# Altium schematic sheet Bridge.SchDoc
size B
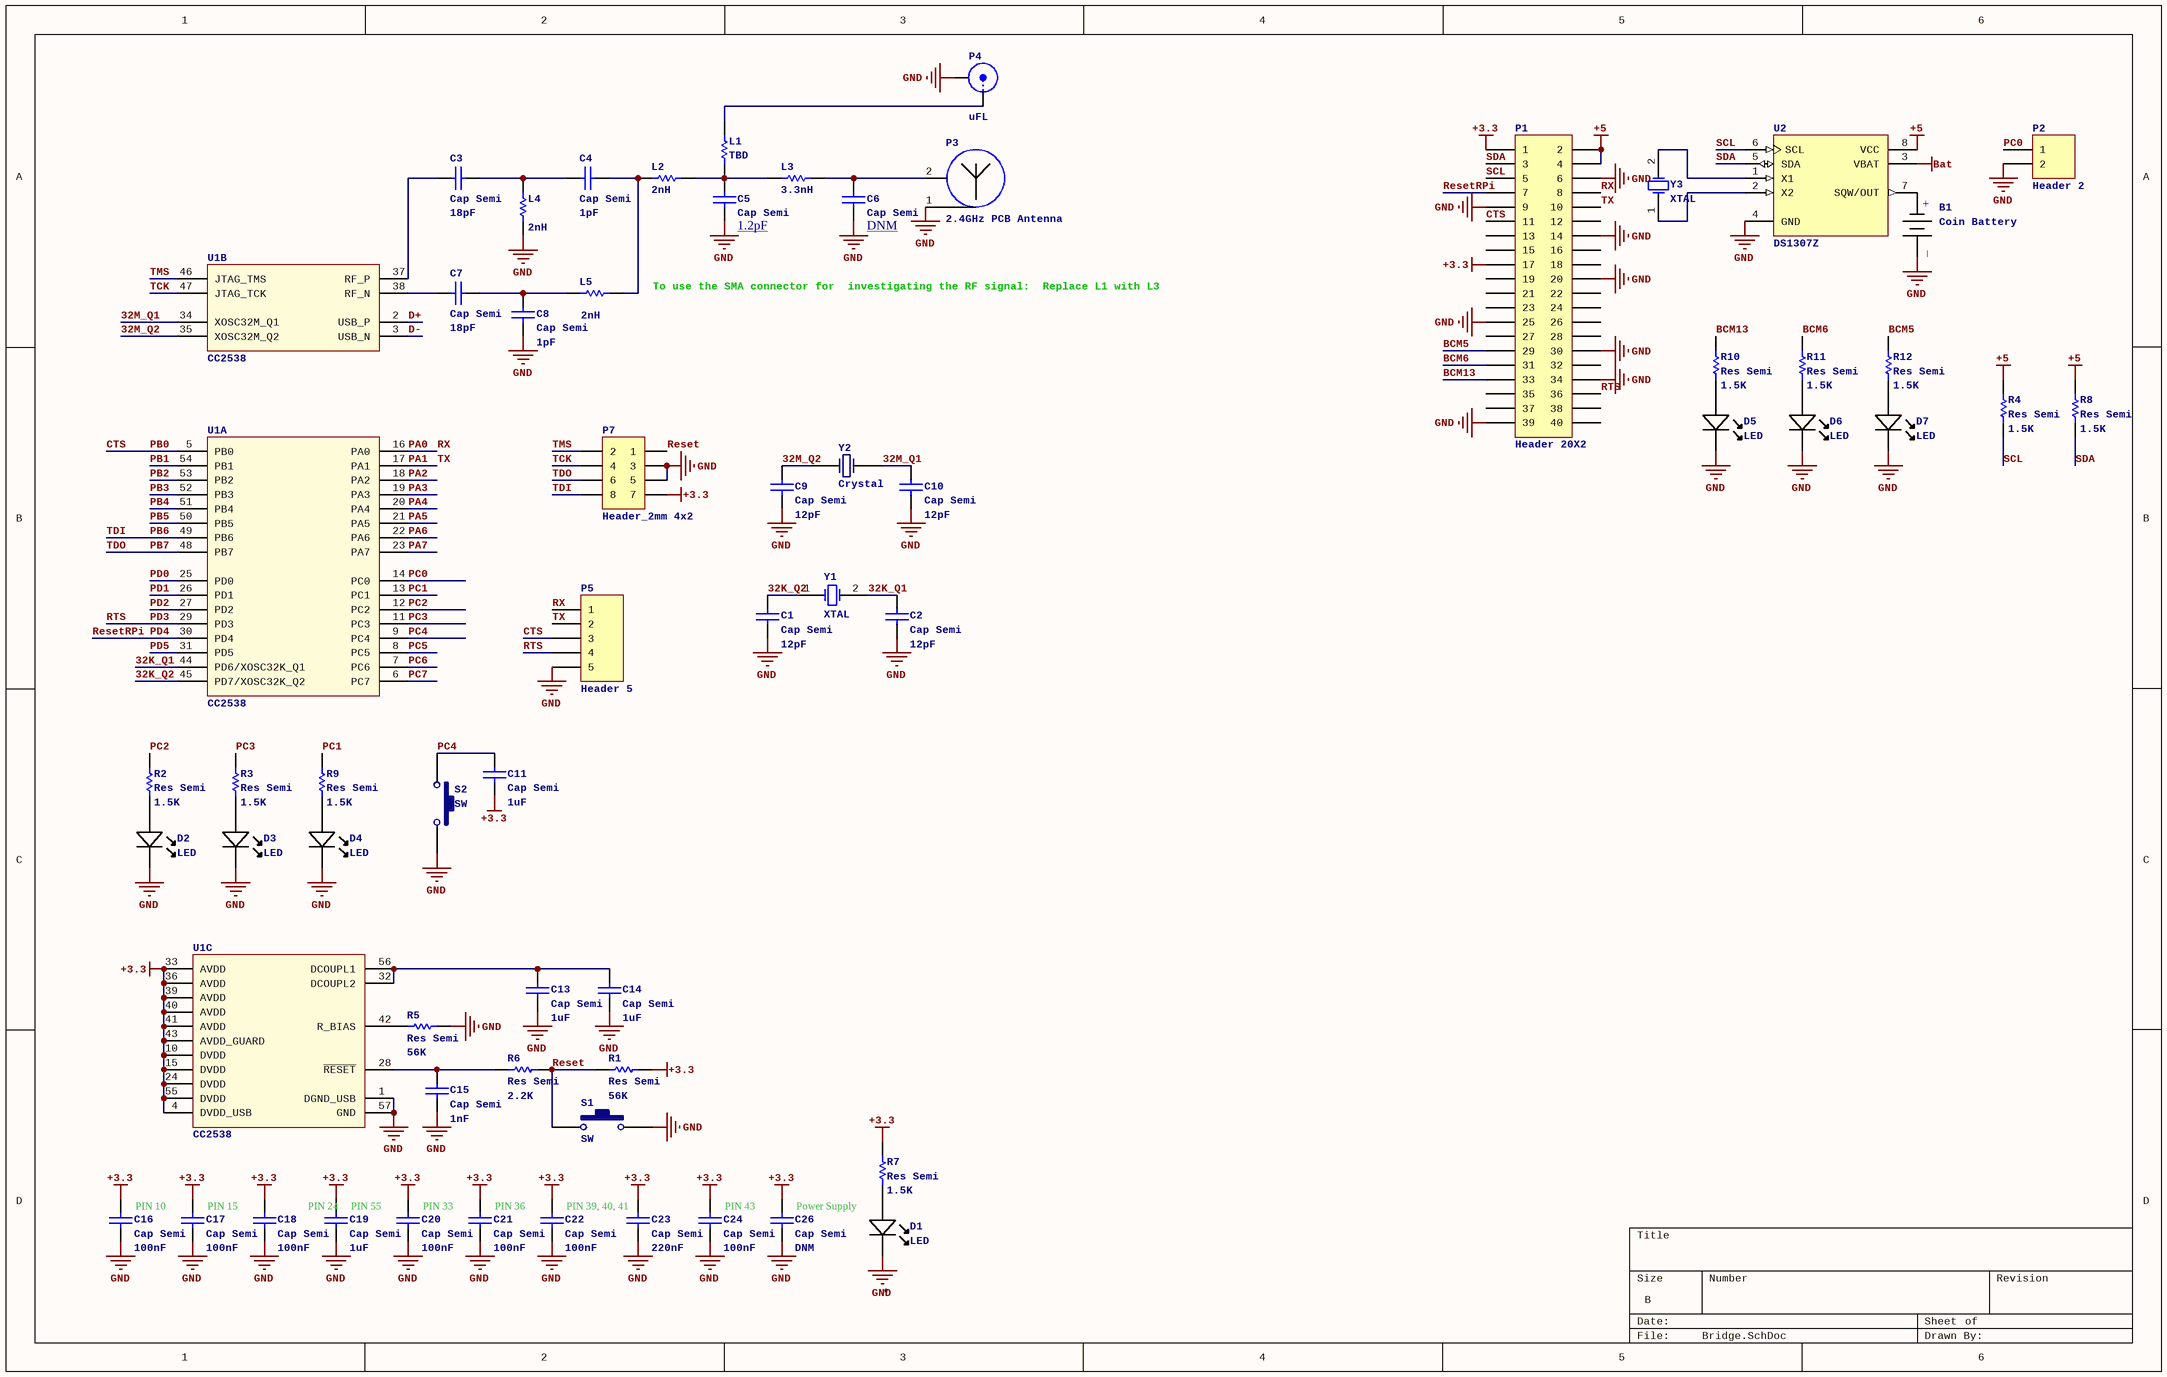
[diagram p0: Bridge.SchDoc]

## Parts
B1  Coin Battery  [Coin Battery 1220]
C1  Cap Semi  value 12pF  [1608[0603]]
C2  Cap Semi  value 12pF  [1608[0603]]
C3  Cap Semi  value 18pF  [1608[0603]]
C4  Cap Semi  value 1pF  [1608[0603]]
C5  Cap Semi  value 1.2pF  [1608[0603]]
C6  Cap Semi  value DNM  [1608[0603]]
C7  Cap Semi  value 18pF  [1608[0603]]
C8  Cap Semi  value 1pF  [1608[0603]]
C9  Cap Semi  value 12pF  [1608[0603]]
C10  Cap Semi  value 12pF  [1608[0603]]
C11  Cap Semi  value 1uF  [1608[0603]]
C13  Cap Semi  value 1uF  [1608[0603]]
C14  Cap Semi  value 1uF  [1608[0603]]
C15  Cap Semi  value 1nF  [1608[0603]]
C16  Cap Semi  value 100nF  [1608[0603]]
C17  Cap Semi  value 100nF  [1608[0603]]
C18  Cap Semi  value 100nF  [1608[0603]]
C19  Cap Semi  value 1uF  [1608[0603]]
C20  Cap Semi  value 100nF  [1608[0603]]
C21  Cap Semi  value 100nF  [1608[0603]]
C22  Cap Semi  value 100nF  [1608[0603]]
C23  Cap Semi  value 220nF  [1608[0603]]
C24  Cap Semi  value 100nF  [1608[0603]]
C26  Cap Semi  value DNM  [1608[0603]]
D1  LED  [LED 0603]
D2  LED  [LED 0603]
D3  LED  [LED 0603]
D4  LED  [LED 0603]
D5  LED  [LED 0603]
D6  LED  [LED 0603]
D7  LED  [LED 0603]
L1  value TBD  [1608[0603]]  (hidden comment: Res Semi)
L2  value 2nH  [1608[0603]]  (hidden comment: Res Semi)
L3  value 3.3nH  [1608[0603]]  (hidden comment: Res Semi)
L4  value 2nH  [1608[0603]]  (hidden comment: Res Semi)
L5  value 2nH  [1608[0603]]  (hidden comment: Res Semi)
P1  Header 20X2  [HDR2X20]
P2  Header 2  [HDR1X2]
P3  2.4GHz PCB Antenna  [2.4 GHz Inverted F Antenna 1]
P4  uFL  [uFL]
P5  Header 5  [HDR1X5]
P7  Header_2mm 4x2  [Header_2mm 4x2]
R1  Res Semi  value 56K  [1608[0603]]
R2  Res Semi  value 1.5K  [1608[0603]]
R3  Res Semi  value 1.5K  [1608[0603]]
R4  Res Semi  value 1.5K  [1608[0603]]
R5  Res Semi  value 56K  [1608[0603]]
R6  Res Semi  value 2.2K  [1608[0603]]
R7  Res Semi  value 1.5K  [1608[0603]]
R8  Res Semi  value 1.5K  [1608[0603]]
R9  Res Semi  value 1.5K  [1608[0603]]
R10  Res Semi  value 1.5K  [1608[0603]]
R11  Res Semi  value 1.5K  [1608[0603]]
R12  Res Semi  value 1.5K  [1608[0603]]
S1  SW  [Switch SMD]
S2  SW  [Switch SMD]
U1  CC2538  [PVQFN56-CC2538]  (parts A,B,C of 3)
U2  DS1307Z  [SOIC8N_N]
Y1  XTAL  [R38]
Y2  Crystal  [Crystal 3225]
Y3  XTAL  [R38]

## Nets
+3.3: C11.1 C16.2 C17.2 C18.2 C19.2 C20.2 C21.2 C22.2 C23.2 C24.2 C26.2 P1.1 P1.17 P7.7 R1.1 R7.2 U1.4(DVDD_USB) U1.10(DVDD) U1.15(DVDD) U1.24(DVDD) U1.33(AVDD) U1.36(AVDD) U1.39(AVDD) U1.40(AVDD) U1.41(AVDD) U1.43(AVDD_GUARD) U1.55(DVDD)
+5: P1.2 P1.4 R4.2 R8.2 U2.8(VCC)
Bat: U2.3(VBAT)
GND: B1.1 C1.1 C2.1 C5.1 C6.1 C8.1 C9.1 C10.1 C13.1 C14.1 C15.1 C16.1 C17.1 C18.1 C19.1 C20.1 C21.1 C22.1 C23.1 C24.1 C26.1 D1.K D2.K D3.K D4.K D5.K D6.K D7.K L4.1 P1.6 P1.9 P1.14 P1.20 P1.25 P1.30 P1.34 P1.39 P2.2 P3.1 P4.2 P5.5 P7.3 P7.5 R5.1 S1.1 S2.1 U1.1(DGND_USB) U1.57(GND) U2.4(GND)
32K_Q1: C2.2 U1.44(PD6/XOSC32K_Q1) Y1.2(OSC2)
32K_Q2: C1.2 U1.45(PD7/XOSC32K_Q2) Y1.1(OSC1)
32M_Q1: C10.2 U1.34(XOSC32M_Q1) Y2.2
32M_Q2: C9.2 U1.35(XOSC32M_Q2) Y2.1
BCM5: P1.29 R12.2
BCM6: P1.31 R11.2
BCM13: P1.33 R10.2
CTS: P1.11 P5.3 U1.5(PB0)  [also labelled PB0]
D+: U1.2(USB_P)
D-: U1.3(USB_N)
PA0: P1.8 P5.1 U1.16(PA0)  [also labelled RX]
PA1: P1.10 P5.2 U1.17(PA1)  [also labelled TX]
PA2: U1.18(PA2)
PA3: U1.19(PA3)
PA4: U1.20(PA4)
PA5: U1.21(PA5)
PA6: U1.22(PA6)
PA7: U1.23(PA7)
PB1: U1.54(PB1)
PB2: U1.53(PB2)
PB3: U1.52(PB3)
PB4: U1.51(PB4)
PB5: U1.50(PB5)
PB6: P7.8 U1.49(PB6)  [also labelled TDI]
PB7: P7.6 U1.48(PB7)  [also labelled TDO]
PC0: P2.1 U1.14(PC0)
PC1: R9.2 U1.13(PC1)
PC2: R2.2 U1.12(PC2)
PC3: R3.2 U1.11(PC3)
PC4: C11.2 S2.2 U1.9(PC4)
PC5: U1.8(PC5)
PC6: U1.7(PC6)
PC7: U1.6(PC7)
PD0: U1.25(PD0)
PD1: U1.26(PD1)
PD2: U1.27(PD2)
PD3: P1.36 P5.4 U1.29(PD3)  [also labelled RTS]
PD4: P1.7 U1.30(PD4)  [also labelled ResetRPi]
PD5: U1.31(PD5)
Reset: P7.1 R1.2 R6.1 S1.2
SCL: P1.5 R4.1 U2.6(SCL)
SDA: P1.3 R8.1 U2.5(SDA)
TCK: P7.4 U1.47(JTAG_TCK)
TMS: P7.2 U1.46(JTAG_TMS)
NetB1_2: B1.2 U2.7(SQW/OUT)
NetC3_1: C3.1 U1.37(RF_P)
NetC3_2: C3.2 C4.1 L4.2
NetC4_2: C4.2 L2.2 L5.2
NetC5_2: C5.2 L1.2 L2.1 L3.2
NetC6_2: C6.2 L3.1 P3.2
NetC7_1: C7.1 U1.38(RF_N)
NetC7_2: C7.2 C8.2 L5.1
NetC13_2: C13.2 C14.2 U1.32(DCOUPL2) U1.56(DCOUPL1)
NetC15_2: C15.2 R6.2 U1.28(~{RESET})
NetD1_A: D1.A R7.1
NetD2_A: D2.A R2.1
NetD3_A: D3.A R3.1
NetD4_A: D4.A R9.1
NetD5_A: D5.A R10.1
NetD6_A: D6.A R11.1
NetD7_A: D7.A R12.1
NetL1_1: L1.1 P4.1
NetR5_2: R5.2 U1.42(R_BIAS)
NetU2_1: U2.1(X1) Y3.2(OSC2)
NetU2_2: U2.2(X2) Y3.1(OSC1)

Not connected (* = marked no-connect by the designer): P1 12 13 15 16 18 19 21 22 23 24 26 27 28 32 35 37 38 40

## Notes on the sheet
- (near L5) To use the SMA connector for  investigating the RF signal:  Replace L1 with L3
- (near C16) PIN 10
- (near C17) PIN 15
- (near C19) PIN 24
- (near C19) PIN 55
- (near C20) PIN 33
- (near C21) PIN 36
- (near C23) PIN 39, 40, 41
- (near C24) PIN 43
- Power Supply
- (in symbol Coin Battery) +; _

## Library data of the parts
C1-C11 C13-C24 C26 = Cap Semi: Capacitor (Semiconductor SIM Model); Published: 8-Jun-2000; LatestRevisionDate: 17-Jul-2002; LatestRevisionNote: Re-released for DXP Platform.; PackageReference: C1206; Publisher: Altium Limited
D1-D7 = LED SMD
L1-L5 R1-R12 = Res Semi: Semiconductor Resistor; Published: 8-Jun-2000; LatestRevisionDate: 17-Jul-2002; LatestRevisionNote: Re-released for DXP Platform.; PackageReference: AXIAL-0.5; Publisher: Altium Limited
P1 = Header 20X2: Header, 20-Pin, Dual row; LatestRevisionDate: 17-Jul-2002; LatestRevisionNote: Re-released for DXP Platform.; Publisher: Altium Limited
P2 = Header 2: Header, 2-Pin; LatestRevisionDate: 17-Jul-2002; LatestRevisionNote: Re-released for DXP Platform.; Publisher: Altium Limited
P5 = Header 5: Header, 5-Pin; LatestRevisionDate: 17-Jul-2002; LatestRevisionNote: Re-released for DXP Platform.; Publisher: Altium Limited
S1 S2 = Switch SMD
U2 = DS1307Z: 64 X 8 Serial Real-Time Clock; Published: 13-Oct-2000; LatestRevisionDate: 13-Apr-2006; LatestRevisionNote: IPC-7351 Footprint Added.; DatasheetVersion: 10-Aug-1999; PackageVersion: 1999; PackageReference: SOIC8N; Publisher: Altium Limited; PackageDescription: 8-Pin Small Outline Integrated Circuit 1.27 mm Pitch; Code_IPC: SOIC127P600-8; ComponentLink1Description: Manufacturer Link; ComponentLink1URL: http://www.maxim-ic.com/; ComponentLink2Description: Datasheet; ComponentLink2URL: http://pdfserv.maxim-ic.com/en/ds/DS1307.pdf; ComponentLink3Description: Discontinuation Notice; ComponentLink3URL: http://www.maxim-ic.com/qa/pdfs/non-obsolescence-letter.pdf
Y1 Y3 = XTAL: Crystal Oscillator; Published: 8-Jun-2000; LatestRevisionDate: 17-Jul-2002; LatestRevisionNote: Re-released for DXP Platform.; PackageReference: R38; Publisher: Altium Limited
Y2 = Xtal